# Altium project Pressure_Vessel.PrjPCB
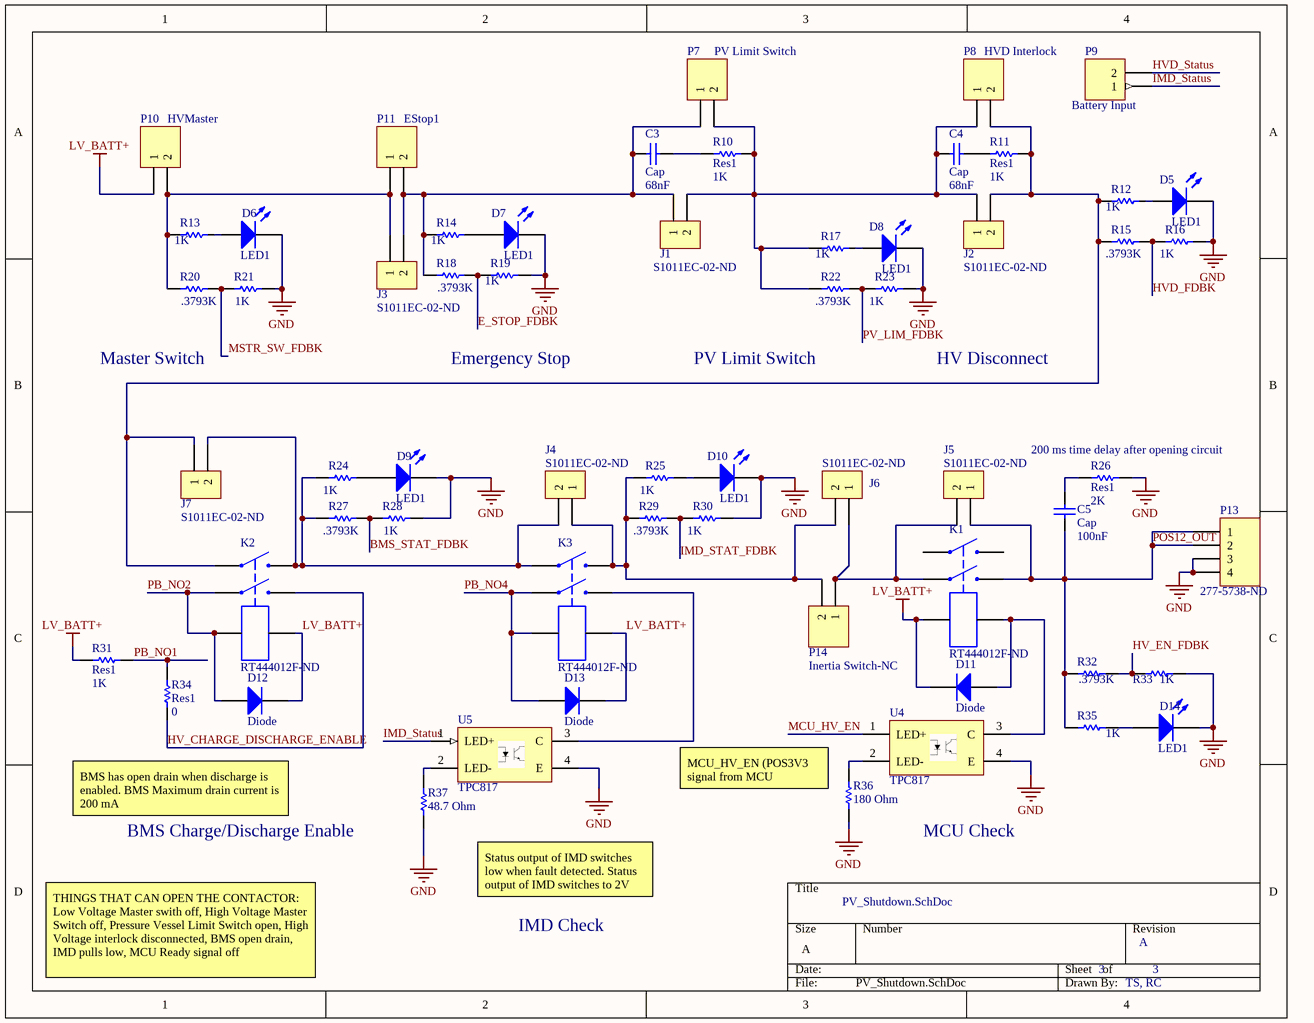
[diagram p0: PV_Shutdown.SchDoc]
3 sheets, 87 parts. Net scope: global (net labels, ports and power ports of the same name join across sheets).
Board files: PV_PCB.PcbDoc, PV_PCB2.PcbDoc
Sheets:
  PV_Shutdown.SchDoc
  PV_BMS_IO.SchDoc
  PV_MotorIO.SchDoc

## Sheet PV_Shutdown.SchDoc
size A

### Parts
C3  Cap  value 68nF  [1206]
C4  Cap  value 68nF  [1206]
C5  Cap  value 100nF  [1206]
D5  LED1  [1206 LED]
D6  LED1  [1206 LED]
D7  LED1  [1206 LED]
D8  LED1  [1206 LED]
D9  LED1  [1206 LED]
D10  LED1  [1206 LED]
D11  Diode  [1N4007]
D12  Diode  [1N4007]
D13  Diode  [1N4007]
D14  LED1  [1206 LED]
J1  S1011EC-02-ND  [2 Pin Jumper]
J2  S1011EC-02-ND  [2 Pin Jumper]
J3  S1011EC-02-ND  [2 Pin Jumper]
J4  S1011EC-02-ND  [2 Pin Jumper]
J5  S1011EC-02-ND  [2 Pin Jumper]
J6  S1011EC-02-ND  [2 Pin Jumper]
J7  S1011EC-02-ND  [2 Pin Jumper]
K1  RT444012F-ND  [RT444012F]
K2  RT444012F-ND  [RT444012F]
K3  RT444012F-ND  [RT444012F]
P7  PV Limit Switch  [2POS TERM BLOCK]
P8  HVD Interlock  [2POS TERM BLOCK]
P9  Battery Input  [2POS TERM BLOCK]
P10  HVMaster  [2POS TERM BLOCK]
P11  EStop1  [2POS TERM BLOCK]
P13  277-5738-ND  [4POS TERM BLOCK]
P14  Inertia Switch-NC  [2POS TERM BLOCK]
R10  Res1  value 1K  [1206]
R11  Res1  value 1K  [1206]
R12  value 1K  [1206]  (hidden comment: Res1)
R13  value 1K  [1206]  (hidden comment: Res1)
R14  value 1K  [1206]  (hidden comment: Res1)
R15  value .3793K  [1206]  (hidden comment: Res1)
R16  value 1K  [1206]  (hidden comment: Res1)
R17  value 1K  [1206]  (hidden comment: Res1)
R18  value .3793K  [1206]  (hidden comment: Res1)
R19  value 1K  [1206]  (hidden comment: Res1)
R20  value .3793K  [1206]  (hidden comment: Res1)
R21  value 1K  [1206]  (hidden comment: Res1)
R22  value .3793K  [1206]  (hidden comment: Res1)
R23  value 1K  [1206]  (hidden comment: Res1)
R24  value 1K  [1206]  (hidden comment: Res1)
R25  value 1K  [1206]  (hidden comment: Res1)
R26  Res1  value 2K  [1206]
R27  value .3793K  [1206]  (hidden comment: Res1)
R28  value 1K  [1206]  (hidden comment: Res1)
R29  value .3793K  [1206]  (hidden comment: Res1)
R30  value 1K  [1206]  (hidden comment: Res1)
R31  Res1  value 1K  [1206]
R32  value .3793K  [1206]  (hidden comment: Res1)
R33  value 1K  [1206]  (hidden comment: Res1)
R34  Res1  value 0  [1206]
R35  value 1K  [1206]  (hidden comment: Res1)
R36  value 180 Ohm  [1206]  (hidden comment: Res1)
R37  value 48.7 Ohm  [1206]  (hidden comment: Res1)
U4  TPC817  [4-SOP]
U5  TPC817  [4-SOP]

### Nets
GND: D5.2(K) D6.2(K) D7.2(K) D8.2(K) D9.2(K) D10.2(K) D14.2(K) P13.3 P13.4 R16.1 R19.1 R21.1 R23.1 R26.2 R28.1 R30.1 R33.1 R36.2 R37.2 U4.4(E) U5.4(E)
LV_BATT+: D11.2(K) D12.2(K) D13.2(K) K1.1 K2.2 K3.2 P10.1 R31.1
BMS_STAT_FDBK: R27.1 R28.2
E_STOP_FDBK: R18.1 R19.2
HV_CHARGE_DISCHARGE_ENABLE: K2.4 R34.1
HV_EN_FDBK: R32.1 R33.2
HVD_FDBK: R15.1 R16.2
HVD_Status: P9.2
IMD_STAT_FDBK: R29.1 R30.2
IMD_Status: P9.1 U5.1(LED+)
MCU_HV_EN: U4.1(LED+)
MSTR_SW_FDBK: R20.1 R21.2
PB_NO1: R31.2 R34.2
PB_NO2: D12.1(A) K2.1 K2.3
PB_NO4: D13.1(A) K3.1 K3.3
POS12_OUT: C5.1 J5.1 K1.4 P13.1 P13.2 R32.2 R35.2
PV_LIM_FDBK: R22.1 R23.2
NetC3_1: C3.1 J1.1 J3.2 P7.1 P11.2 R14.1 R18.2
NetC3_2: C3.2 R10.1
NetC4_1: C4.1 J1.2 J2.1 P7.2 P8.1 R10.2 R17.1 R22.2
NetC4_2: C4.2 R11.1
NetC5_2: C5.2 R26.1
NetD5_1: D5.1(A) R12.2
NetD6_1: D6.1(A) R13.2
NetD7_1: D7.1(A) R14.2
NetD8_1: D8.1(A) R17.2
NetD9_1: D9.1(A) R24.2
NetD10_1: D10.1(A) R25.2
NetD11_1: D11.1(A) K1.2 U4.3(C)
NetD14_1: D14.1(A) R35.1
NetJ2_2: J2.2 J7.1 K2.5 P8.2 R11.2 R12.1 R15.2
NetJ3_1: J3.1 P10.2 P11.1 R13.1 R20.2
NetJ4_1: J4.1 J6.2 K3.6 P14.2 R25.1 R29.2
NetJ4_2: J4.2 J7.2 K2.6 K3.5 R24.1 R27.2
NetJ5_2: J5.2 J6.1 K1.3 P14.1
NetK3_4: K3.4 U5.3(C)
NetR36_1: R36.1 U4.2(LED-)
NetR37_1: R37.1 U5.2(LED-)

Not connected (* = marked no-connect by the designer): K1 5 6

### Notes on the sheet
- Master Switch
- Emergency Stop
- PV Limit Switch
- HV Disconnect
- (near R26) 200 ms time delay after opening circuit
- BMS has open drain when discharge is enabled. BMS Maximum drain current is 200 mA
- (near R37) BMS Charge/Discharge Enable
- (near R36) MCU_HV_EN (POS3V3 signal from MCU
- MCU Check
- Status output of IMD switches low when fault detected. Status output of IMD switches to 2V when no fault is present
- PV_Shutdown.SchDoc
- THINGS THAT CAN OPEN THE CONTACTOR: Low Voltage Master swith off, High Voltage Master Switch off, Pressure Vessel Limit Switch open, High Voltage interlock disconnected, BMS open drain, IMD pulls low, MCU Ready signal off
- IMD Check
- 3
- A
- TS, RC

### Library data of the parts
C3-C5 = Cap: Capacitor; Published: 8-Jun-2000; LatestRevisionDate: 17-Jul-2002; LatestRevisionNote: Re-released for DXP Platform.; PackageReference: RAD-0.3; Publisher: Altium Limited; PackageDescription: Radial Cap, Thru-Hole; 2 Leads; 0.3 in Pin Spacing
D5-D10 D14 = LED1: Typical RED GaAs LED; Published: 8-Jun-2000; LatestRevisionDate: 08-Jul-2005; LatestRevisionNote: Mech Layer 1 removed.; PackageReference: LED-1; Publisher: Altium Limited; PackageDescription: LED; 2 Leads
D11-D13 = Diode: Default Diode; Published: 8-Jun-2000; LatestRevisionDate: 17-Jul-2002; LatestRevisionNote: Re-released for DXP Platform.; PackageVersion: Sep-1996; PackageReference: SMC; Publisher: Altium Limited; PackageDescription: DO-214-AB/SMC; 2 C-Bend Leads; Body 7.9 x 5.9 mm, inc. leads (LxW); Code_JEDEC: DO-214-AB
J1-J7 = S1011EC-02-ND: CONN HEADER .100" SNGL STR 2POS; ComponentLink1Description: Male- Digikey; ComponentLink1URL: https://www.digikey.com/product-detail/en/sullins-connector-solutions/PRPC002SAAN-RC/S1011EC-02-ND/2775252; ComponentLink2Description: Female - Digikey; ComponentLink2URL: https://www.digikey.com/products/en?keywords=S9001-ND
K1-K3 = RT444012F-ND: RELAY GEN PURPOSE DPST 8A 12V; ComponentLink1Description: Digikey; ComponentLink1URL: https://www.digikey.com/product-detail/en/te-connectivity-potter-brumfield-relays/RT444012F/RT444012F-ND/1427665
P7 P8 P10 P11 P14 = Header 2: 277-5733-ND; LatestRevisionDate: 17-Jul-2002; LatestRevisionNote: Re-released for DXP Platform.; Publisher: Altium Limited
  P14: ComponentLink1Description: Electric Motor Sport; ComponentLink1URL: http://www.electricmotorsport.com/resettable-inertia-switch-crash-sensor-kit.html
P9 = Header 2: Header, 2-Pin; LatestRevisionDate: 17-Jul-2002; LatestRevisionNote: Re-released for DXP Platform.; Publisher: Altium Limited
P13 = Header 4: Header, 4-Pin; LatestRevisionDate: 17-Jul-2002; LatestRevisionNote: Re-released for DXP Platform.; Publisher: Altium Limited
R10-R37 = Res1: Resistor; Published: 8-Jun-2000; LatestRevisionDate: 17-Jul-2002; LatestRevisionNote: Re-released for DXP Platform.; PackageReference: AXIAL-0.3; Publisher: Altium Limited; PackageDescription: Axial Device, Thru-Hole; 2 Leads; 0.3 in Pin Spacing
U4 U5 = TPC817: Opto-Coupler; ComponentLink1Description: Digi-Key; ComponentLink1URL: https://www.digikey.com/product-detail/en/taiwan-semiconductor-corporation/TPC817S1D-RAG/TPC817S1D-RAGCT-ND/7359685; ComponentLink2Description: Datasheet; ComponentLink2URL: http://www.taiwansemi.com/products/datasheet/TPC817%20SERIES_C1612.pdf

## Sheet PV_BMS_IO.SchDoc
size A
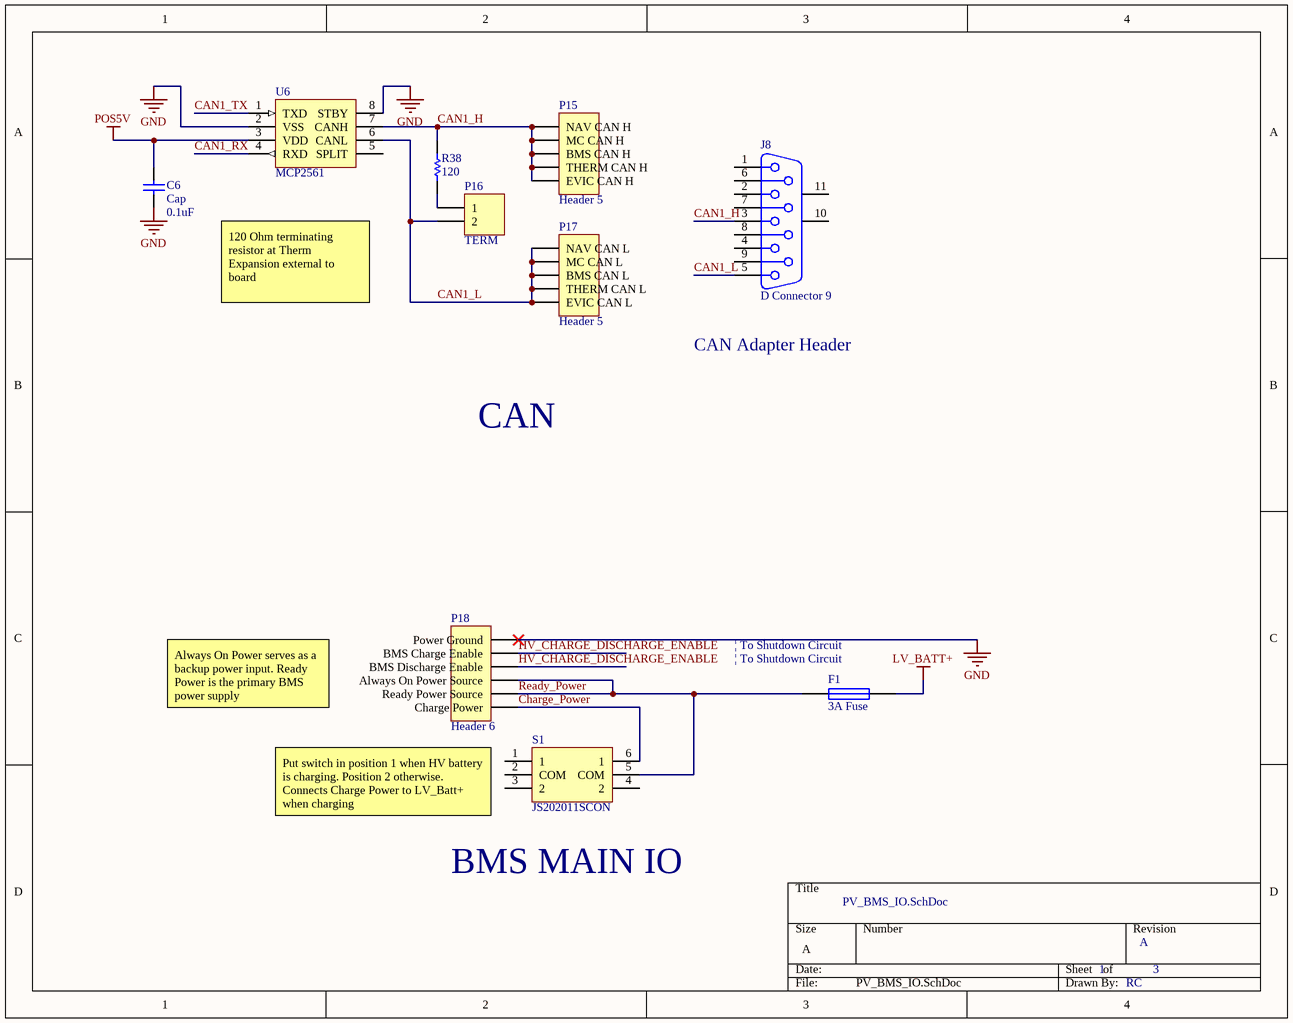
[diagram p1: PV_BMS_IO.SchDoc]

### Parts
C6  Cap  value 0.1uF  [1206]
F1  3A Fuse  [1A FUSE HOLDER]
J8  D Connector 9  [DSUB1.385-2H9]
P15  Header 5  [5POS TERM BLOCK]
P16  TERM  [HDR1X2]
P17  Header 5  [5POS TERM BLOCK]
P18  Header 6  [6POS TERM BLOCK]
R38  value 120  [1206]  (hidden comment: Res1)
S1  JS202011SCON  [JS202011SCON]
U6  MCP2561  [8-SOIC]

### Nets
GND: C6.1 P18.6(Power_Ground) U6.2(VSS) U6.8(STBY)
LV_BATT+: F1.2
POS5V: C6.2 U6.3(VDD)
CAN1_H: J8.3 P15.1(NAV_CAN_H) P15.2(MC_CAN_H) P15.3(BMS_CAN_H) P15.4(THERM_CAN_H) P15.5(EVIC_CAN_H) R38.2 U6.7(CANH)
CAN1_L: J8.5 P16.2 P17.1(NAV_CAN_L) P17.2(MC_CAN_L) P17.3(BMS_CAN_L) P17.4(THERM_CAN_L) P17.5(EVIC_CAN_L) U6.6(CANL)
CAN1_RX: U6.4(RXD)
CAN1_TX: U6.1(TXD)
Charge_Power: P18.1(Charge_Power) S1.6(1)
HV_CHARGE_DISCHARGE_ENABLE: P18.4(BMS_Discharge_Enable) P18.5(BMS_Charge_Enable)
Ready_Power: F1.1 P18.2(Ready_Power_Source) P18.3(Always_On_Power_Source) S1.5(COM)
NetP16_1: P16.1 R38.1

Not connected (* = marked no-connect by the designer): J8 1 2 4 6 7 8 9 10(MH1) 11(MH2); S1 1 2(COM) 3(2) 4(2); U6 5(SPLIT)

### Notes on the sheet
- 120 Ohm terminating resistor at Therm Expansion external to board
- CAN Adapter Header
- CAN
- Always On Power serves as a backup power input. Ready Power is the primary BMS power supply
- (near F1) | To Shutdown Circuit
- Put switch in position 1 when HV battery is charging. Position 2 otherwise.                   Connects Charge Power to LV_Batt+ when charging
- BMS MAIN IO
- PV_BMS_IO.SchDoc
- 1
- A
- 3
- RC

### Library data of the parts
C6 = Cap: Capacitor; Published: 8-Jun-2000; LatestRevisionDate: 17-Jul-2002; LatestRevisionNote: Re-released for DXP Platform.; PackageReference: RAD-0.3; Publisher: Altium Limited; PackageDescription: Radial Cap, Thru-Hole; 2 Leads; 0.3 in Pin Spacing
F1 = Fuse 1: Fuse; Published: 8-Jun-2000; LatestRevisionDate: 17-Jul-2002; LatestRevisionNote: Re-released for DXP Platform.; PackageReference: PIN-W2/E2.8; Publisher: Altium Limited; PackageDescription: Thru-Hole; 2 Leads; ComponentLink1Description: Digikey; ComponentLink1URL: F1226CT-ND
J8 = D Connector 9: Receptacle Assembly, 9 Position, Right Angle; PackageDocument: O; Positions: 9; Published: 15-Jun-2001; LatestRevisionDate: 17-Jul-2002; LatestRevisionNote: Re-released for DXP Platform.; DatasheetDocument: 1-Sep-1999; PackageReference: 788750; Publisher: Altium Limited; Orientation: Right Angle; Gender: Receptacle
P15 P17 = Header 5: Header, 5-Pin; LatestRevisionDate: 17-Jul-2002; LatestRevisionNote: Re-released for DXP Platform.; Publisher: Altium Limited
P16 = Header 2: Header, 2-Pin; LatestRevisionDate: 17-Jul-2002; LatestRevisionNote: Re-released for DXP Platform.; Publisher: Altium Limited
P18 = Header 6: Header, 6-Pin; LatestRevisionDate: 17-Jul-2002; LatestRevisionNote: Re-released for DXP Platform.; Publisher: Altium Limited
R38 = Res1: Resistor; Published: 8-Jun-2000; LatestRevisionDate: 17-Jul-2002; LatestRevisionNote: Re-released for DXP Platform.; PackageReference: AXIAL-0.3; Publisher: Altium Limited; PackageDescription: Axial Device, Thru-Hole; 2 Leads; 0.3 in Pin Spacing
S1 = JS202011SCON: DPST Switch; ComponentLink1Description: Digikey; ComponentLink1URL: https://www.digikey.com/product-detail/en/c-k/JS202011SCQN/401-2002-1-ND/1640098
U6 = MCP2561: CAN Transciever; ComponentLink1Description: Part; ComponentLink1URL: https://www.digikey.com/product-detail/en/microchip-technology/MCP2561-E-SN/MCP2561-E-SN-ND/4079961; ComponentLink2Description: Datasheet; ComponentLink2URL: http://ww1.microchip.com/downloads/en/DeviceDoc/20005167C.pdf

## Sheet PV_MotorIO.SchDoc
size A
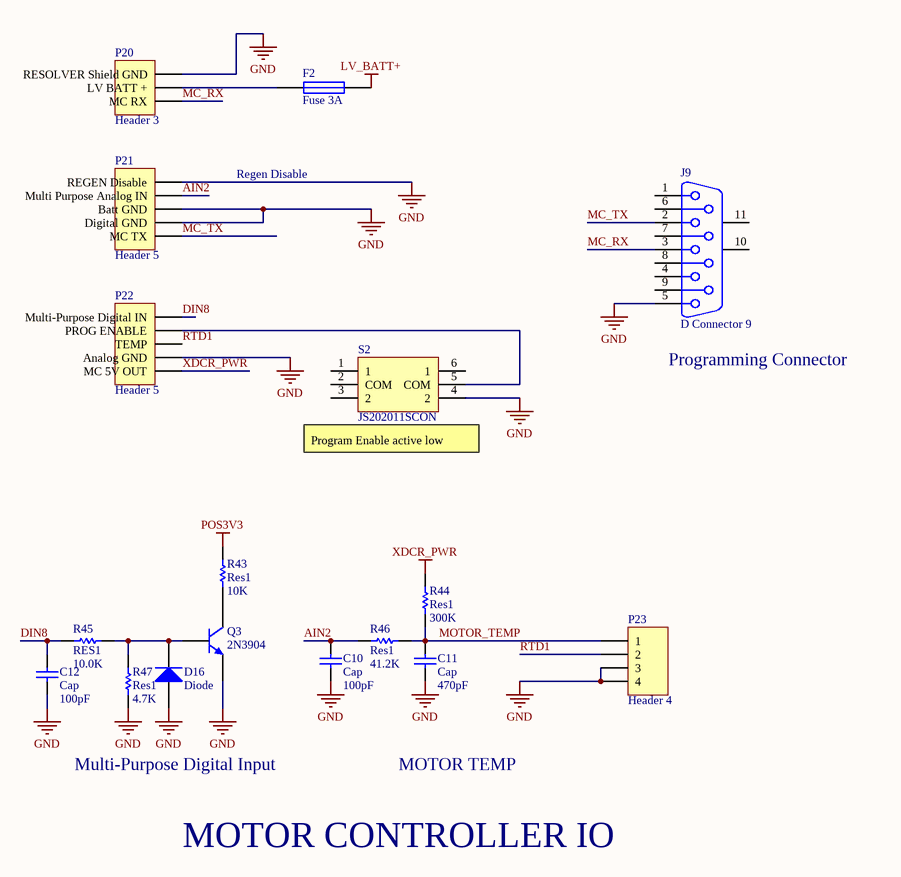
[diagram p2: PV_MotorIO.SchDoc]

### Parts
C10  Cap  value 100pF  [1206]
C11  Cap  value 470pF  [1206]
C12  Cap  value 100pF  [1206]
D16  Diode  [1206 DIODE]
F2  Fuse 3A  [1A FUSE HOLDER]
J9  D Connector 9  [DSUB1.385-2H9]
P20  Header 3  [3POS TERM BLOCK]
P21  Header 5  [5POS TERM BLOCK]
P22  Header 5  [5POS TERM BLOCK]
P23  Header 4  [4POS TERM BLOCK]
Q3  2N3904  [BJT]
R43  Res1  value 10K  [1206]
R44  Res1  value 300K  [1206]
R45  RES1  value 10.0K  [1206]
R46  Res1  value 41.2K  [1206]
R47  Res1  value 4.7K  [1206]
S2  JS202011SCON  [JS202011SCON]

### Nets
GND: C10.1 C11.1 C12.1 D16.1(A) J9.5 P20.3(RESOLVER_Shield_GND) P21.2(Digital_GND) P21.3(Batt_GND) P21.5(REGEN_Disable) P22.2(Analog_GND) P23.3 P23.4 Q3.1(E) R47.1 S2.4(2)
LV_BATT+: F2.2
POS3V3: R43.2
XDCR_PWR: P22.1(MC_5V_OUT) R44.2
AIN2: C10.2 P21.4(Multi_Purpose_Analog_IN) R46.2
DIN8: C12.2 P22.5(Multi-Purpose_Digital_IN) R45.1
MC_RX: J9.3 P20.1(MC_RX)
MC_TX: J9.2 P21.1(MC_TX)
MOTOR_TEMP: C11.2 P23.1 R44.1 R46.1
RTD1: P22.3(TEMP) P23.2
NetD16_2: D16.2(K) Q3.2(B) R45.2 R47.2
NetF2_1: F2.1 P20.2(LV_BATT_+)
NetP22_4: P22.4(PROG_ENABLE) S2.5(COM)
NetQ3_3: Q3.3(C) R43.1

Not connected (* = marked no-connect by the designer): J9 1 4 6 7 8 9 10(MH1) 11(MH2); S2 1 2(COM) 3(2) 6(1)

### Notes on the sheet
- Regen Disable
- (near J9) Programming Connector
- (near S2) Program Enable active low
- Multi-Purpose Digital Input
- MOTOR TEMP
- MOTOR CONTROLLER IO

### Library data of the parts
C10-C12 = Cap: Capacitor; Published: 8-Jun-2000; LatestRevisionDate: 17-Jul-2002; LatestRevisionNote: Re-released for DXP Platform.; PackageReference: RAD-0.3; Publisher: Altium Limited; PackageDescription: Radial Cap, Thru-Hole; 2 Leads; 0.3 in Pin Spacing
D16 = Diode: Default Diode; Published: 8-Jun-2000; LatestRevisionDate: 17-Jul-2002; LatestRevisionNote: Re-released for DXP Platform.; PackageVersion: Sep-1996; PackageReference: SMC; Publisher: Altium Limited; PackageDescription: DO-214-AB/SMC; 2 C-Bend Leads; Body 7.9 x 5.9 mm, inc. leads (LxW); Code_JEDEC: DO-214-AB
F2 = Fuse 1: Fuse; Published: 8-Jun-2000; LatestRevisionDate: 17-Jul-2002; LatestRevisionNote: Re-released for DXP Platform.; PackageReference: PIN-W2/E2.8; Publisher: Altium Limited; PackageDescription: Thru-Hole; 2 Leads; ComponentLink1Description: Digikey- FUSE; ComponentLink1URL: https://www.digikey.com/product-detail/en/littelfuse-inc/0451001.MRL/F2577CT-ND/813055; ComponentLink2Description: Digikey - Holder; ComponentLink2URL: https://www.digikey.com/product-detail/en/littelfuse-inc/0154001.DR/F1222TR-ND/183352
J9 = D Connector 9: as J8 on sheet PV_BMS_IO; Published: 15-Jun-2001; LatestRevisionDate: 17-Jul-2002; LatestRevisionNote: Re-released for DXP Platform.; DatasheetDocument: 1-Sep-1999; PackageReference: 788750; Publisher: Altium Limited; Orientation: Right Angle; Gender: Receptacle
P20 = Header 3: Header, 3-Pin; LatestRevisionDate: 17-Jul-2002; LatestRevisionNote: Re-released for DXP Platform.; Publisher: Altium Limited
P21 P22 = Header 5: Header, 5-Pin; LatestRevisionDate: 17-Jul-2002; LatestRevisionNote: Re-released for DXP Platform.; Publisher: Altium Limited
P23 = Header 4: Header, 4-Pin; LatestRevisionDate: 17-Jul-2002; LatestRevisionNote: Re-released for DXP Platform.; Publisher: Altium Limited
Q3 = 2N3904: NPN General Purpose Amplifier; Published: 8-Jun-2000; LatestRevisionDate: 15-Jan-2003; LatestRevisionNote: PCB Footprint 'BCY-W3/D4.7' replaced; DatasheetVersion: 1997; PackageVersion: Sep-1998; PackageReference: TO-92A; Publisher: Altium Limited; PackageDescription: TO, Flat Index; 3 In-Line, Axial Leads; Body Dia. 4.5mm; Leads 0.51 x 0.48 mm (max); ComponentLink1Description: Manufacturer Link; ComponentLink1URL: http://www.fairchildsemi.com/; ComponentLink2Description: Datasheet; ComponentLink2URL: http://www.mccsemi.com/up_pdf/2N3904(TO-92).pdf
R43-R47 = Res1: Resistor; Published: 8-Jun-2000; LatestRevisionDate: 17-Jul-2002; LatestRevisionNote: Re-released for DXP Platform.; PackageReference: AXIAL-0.3; Publisher: Altium Limited; PackageDescription: Axial Device, Thru-Hole; 2 Leads; 0.3 in Pin Spacing
S2 = JS202011SCON: DPST Switch; ComponentLink1Description: Digikey; ComponentLink1URL: https://www.digikey.com/product-detail/en/c-k/JS202011SCQN/401-2002-1-ND/1640098

## Nets that join several sheets
GND: PV_Shutdown (21 pins), PV_BMS_IO (C6.1 P18.6 U6.2 U6.8), PV_MotorIO (15 pins)
LV_BATT+: PV_Shutdown (8 pins), PV_BMS_IO (F1.2), PV_MotorIO (F2.2)
HV_CHARGE_DISCHARGE_ENABLE: PV_Shutdown (K2.4 R34.1), PV_BMS_IO (P18.4 P18.5)